# Altium schematic sheet AMS1117.SchDoc
size A
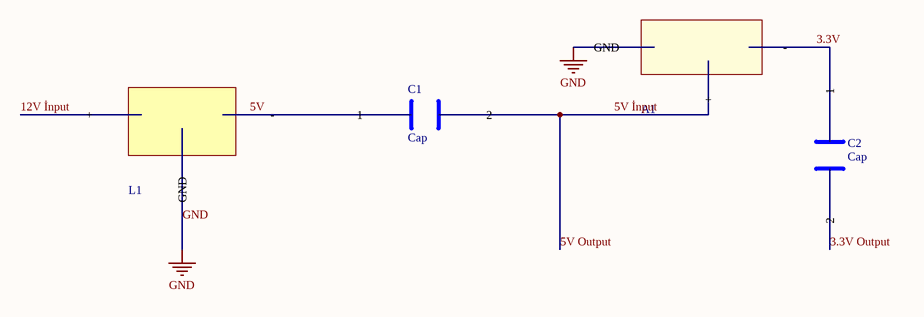
[diagram p0: AMS1117.SchDoc]

## Parts
A1  AMSRegülatör  [AMS1117-3,3]  (value not drawn)
C1  Cap  [Cap1]
C2  Cap  [Cap1]
L1  LMRegülatör  [LM7805]  (value not drawn)

## Nets
GND: A1.GND L1.GND
3.3V: A1.- C2.1
3.3V Output: C2.2
5V: C1.1 L1.-
5V İnput: A1.+ C1.2  [also labelled 5V Output]
12V İnput: L1.+

## Library data of the parts
A1 = AMS1117-3.3: Crimper, Wire Special For 16740; Manufacturer: Advanced Monolithic Systems; Supplier 1: LCSC; Manufacturer Part Number: AMS1117-3.3; Stock 1: 596858; Pricing 1: 1=0.1869, 10=0.135, 30=0.1256, 100=0.1163, 500=0.11, 1000=0.109, 1=0.1712, 10=0.1236, 30=0.115, 100=0.1065, 500=0.1008, 1000=0.0998, 1=0.8475, 10=0.612, 30=0.5697, 100=0.5272, 500=0.499, 1000=0.4943, 1=0.8153, 10=0.5888, 30=0.548, 100=0.5071, 500=0.48, 1000=0.4755, 1=0.1082, 10=0.0781, 30=0.0727, 100=0.0673, 500=0.0637, 1000=0.0631, 1=0.096, 10=0.0693, 30=0.0645, 100=0.0597, 500=0.0565, 1000=0.056, 1=0.9316, 10=0.6727, 30=0.6261, 100=0.5795, 500=0.5485, 1000=0.5433, 1=12.8319, 10=9.2663, 30=8.6249, 100=7.9818, 500=7.5548, 1000=7.4834, 1=0.5157, 10=0.3724, 30=0.3466, 100=0.3208, 500=0.3036, 1000=0.3008, 1=9.0461, 10=6.5324, 30=6.0803, 100=5.6269, 500=5.3259, 1000=5.2756, 1=1.181, 10=0.8528, 30=0.7938, 100=0.7346, 500=0.6953, 1000=0.6887, 1=0.1699, 10=0.1227, 30=0.1142, 100=0.1057, 500=0.1, 1000=0.0991, 1=0.12, 10=0.08666, 30=0.08066, 100=0.07465, 500=0.07065, 1000=0.06998 (AUD)
C1 C2 = R82DC3100DQ50J: CAPACITOR POLY FILM FILM 0.1UF, 5%, 63V,; Manufacturer: KEMET; Dielectric Material: PET; Capacitance: 100nF; Voltage Rating (AC): 40V; Life (Hours): 2000Hour; Dissipation Factor: 80%; Type: General Purpose; Lead Diameter: 0.5mm; Supplier 1: Digi-Key; Manufacturer Part Number: R82DC3100DQ50J; Stock 1: 63956; Pricing 1: 1=0.31, 10=0.211, 100=0.1196, 500=0.08446, 1000=0.0739 (USD); Mount: Through Hole; Case/Package: Radial; Number of Pins: 2; Min Operating Temperature: -55°C; Max Operating Temperature: 105°C; Tolerance: 5%; Dielectric: PET; Termination: Radial; Voltage Rating: 63V; Package Quantity: 3500; Voltage Rating (DC): 63V; Packaging: Tape and Reel; Voltage: 63V; Length: 7.2mm; Height: 6.5mm; Lead Pitch: 5mm; Depth: 2.5mm; Width: 0.098inch; Height - Seated (Max): 0.26inch; Radiation Hardening: No; REACH SVHC: No SVHC; ComponentLink1URL: http://uk.rs-online.com/webdocs/1515/0900766b815154ac.pdf?src-supplier=RSComponents; ComponentLink1Description: http://uk.rs-online.com/webdocs/1515/0900766b815154ac.pdf?src-supplier=RSComponents; ComponentLink2URL: https://www.verical.com/server-webapp/html/getDatasheet?partID=151946&src-supplier=Verical; ComponentLink2Description: https://www.verical.com/server-webapp/html/getDatasheet?partID=151946&src-supplier=Verical; ComponentLink3URL: http://www.mouser.com/ds/2/212/KEM_F3101_R82-1103738.pdf?src-supplier=Mouser; ComponentLink3Description: http://www.mouser.com/ds/2/212/KEM_F3101_R82-1103738.pdf?src-supplier=Mouser; ComponentLink4URL: https://www.alliedelec.com/m/d/c7abfacc3ab5460f71cee4e24a650bb0.pdf?src-supplier=Allied+Electronics; ComponentLink4Description: https://www.alliedelec.com/m/d/c7abfacc3ab5460f71cee4e24a650bb0.pdf?src-supplier=Allied+Electronics; ComponentLink5URL: http://www.farnell.com/datasheets/1831763.pdf?src-supplier=Element14; ComponentLink5Description: http://www.farnell.com/datasheets/1831763.pdf?src-supplier=Element14
L1 = LM7805CT/NOPB: Series 3-Terminal Positive Regulators; Manufacturer: Texas Instruments; Quiescent Current: 8mA; Output Voltage: 5V; Number of Outputs: 1; Max Input Voltage: 35V; Dropout Voltage: 2V; Output Type: Fixed; Output Current: 1A; Min Input Voltage: 10V; Accuracy: 2%; Supplier 1: Digi-Key; Manufacturer Part Number: LM7805CT/NOPB; Stock 1: 25093; Pricing 1: 1=1.54, 10=1.381, 25=1.3024, 100=1.042, 250=0.91176, 500=0.8857, 1000=0.70335, 2500=0.6773, 5000=0.65125 (USD); Mount: Through Hole; Case/Package: TO-220; Number of Pins: 3; Min Operating Temperature: 0°C; Max Operating Temperature: 125°C; Polarity: Positive; Packaging: Rail/Tube; Number of Regulators: 1; Output Voltage Accuracy: 2%; Max Output Current: 1A; Package Quantity: 45; Length: 10.16mm; Height: 8.89mm; Width: 4.7mm; Radiation Hardening: No; Lead Free: Contains Lead; ComponentLink1URL: http://www.jameco.com/Jameco/Products/ProdDS/902071.pdf?src-supplier=Jameco; ComponentLink1Description: http://www.jameco.com/Jameco/Products/ProdDS/902071.pdf?src-supplier=Jameco; ComponentLink2URL: http://www.ti.com/lit/ds/symlink/lm7805c.pdf?src-supplier=Digi-Key; ComponentLink2Description: http://www.ti.com/lit/ds/symlink/lm7805c.pdf?src-supplier=Digi-Key; ComponentLink3URL: http://www.ti.com/general/docs/lit/getliterature.tsp?genericPartNumber=LM7815C&&fileType=pdf&src-supplier=Avnet; ComponentLink3Description: http://www.ti.com/general/docs/lit/getliterature.tsp?genericPartNumber=LM7815C&&fileType=pdf&src-supplier=Avnet